# EAGLE design stirplate (EAGLE 6.5.0)
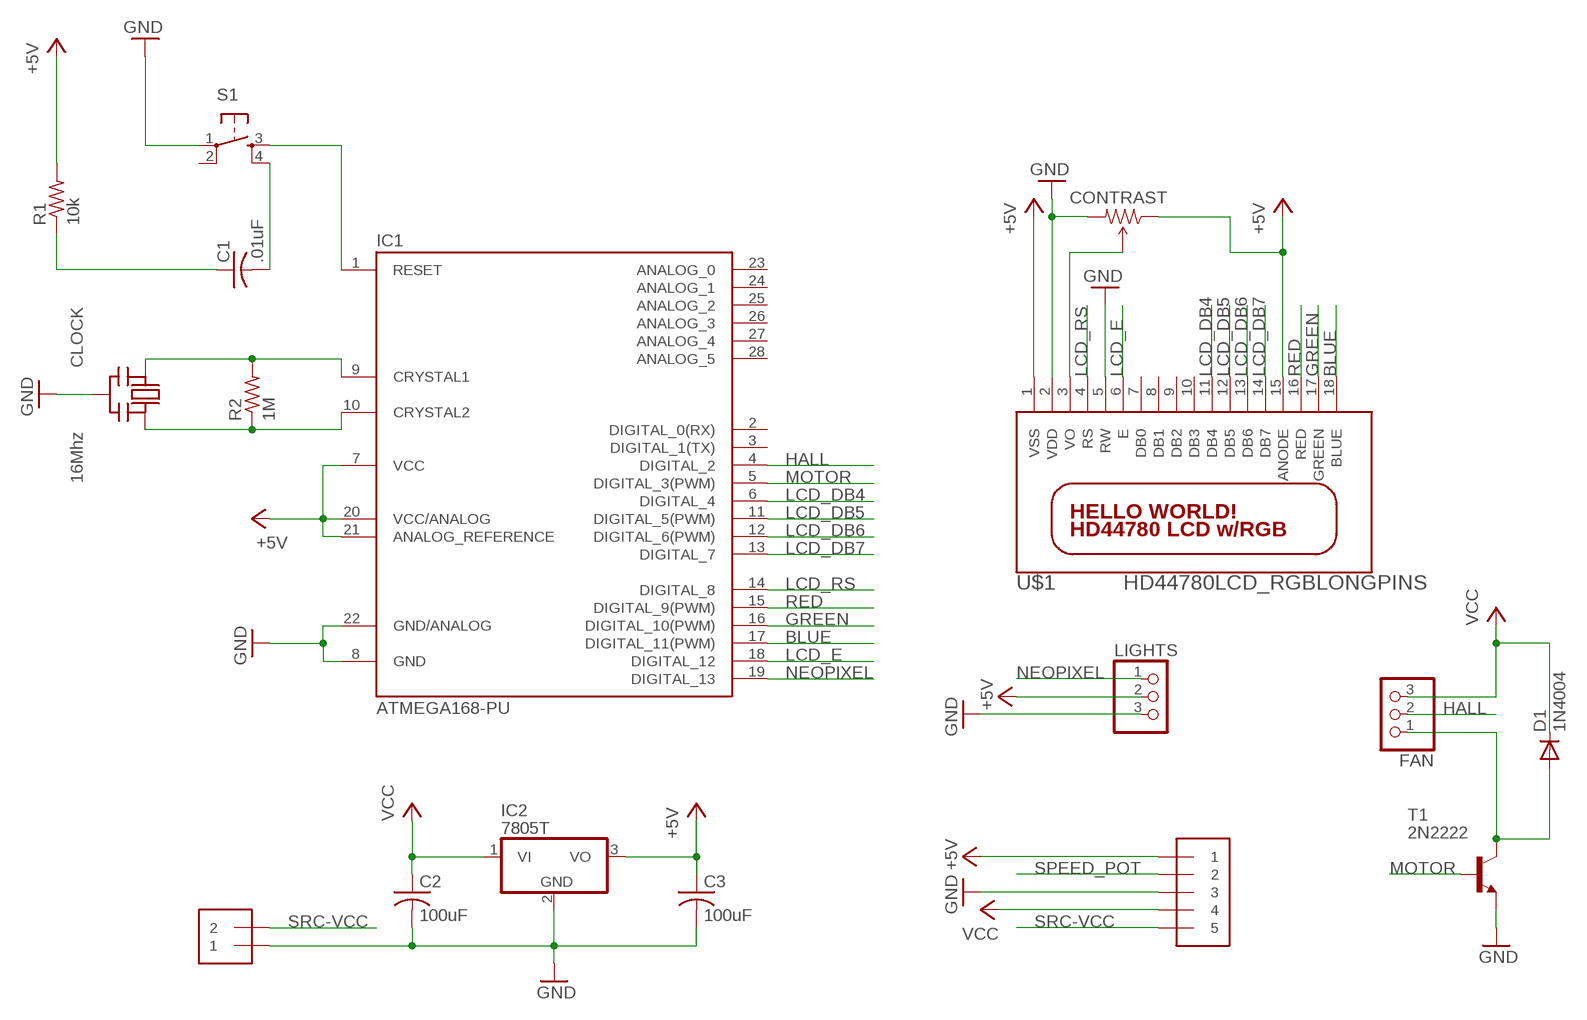
[diagram p0: schematic, sheet 1]

## Parts
C1  .01uF  C-US025-030X050  [C025-030X050]
C2  100uF  C-US025-030X050  [C025-030X050]
C3  100uF  C-US025-030X050  [C025-030X050]
CLOCK  16Mhz  CERMOSCILL-THM  [CERM_OSC]
CONTRAST  TRIMPOTPTH  [TRIM_POT_PTH]
D1  1N4004  [DO41-10]
FAN  PINHD-1X3CB  [1X03-CLEANBIG]
IC1  ATMEGA168-PU  [DIL28-3]
IC2  7805T  [TO220H]
LIGHTS  PINHD-1X3  [1X03]
POWER  1X2-3.5MM  [1X2-3.5MM]
R1  10k  R-US_0204/7  [0204/7]
R2  1M  R-US_0204/7  [0204/7]
S1  TAC_SWITCHPTH  [TACTILE-PTH]
SPEED  1X5  [1X05-3.5MM]
T1  2N2222  [TO92-EBC-OVAL]
U$1  HD44780LCD_RGBLONGPINS  [LCD1602-RGB]

## Nets
+5V [Vcc]: C3.1 CONTRAST.1(CCW) IC1.7(VCC) IC1.20(VCC/ANALOG) IC1.21(ANALOG_REFERENCE) IC2.3(VO) LIGHTS.2 R1.2 SPEED.1 U$1.15(ANODE)
BLUE: IC1.17(DIGITAL_11(PWM)) U$1.18(BLUE)
GND [Vcc]: C2.2 C3.2 CLOCK.P$2(GND) IC1.8(GND) IC1.22(GND/ANALOG) IC2.2(GND) LIGHTS.3 POWER.1 S1.1 SPEED.3 T1.E U$1.5(RW)
GREEN: IC1.16(DIGITAL_10(PWM)) U$1.17(GREEN)
HALL: FAN.2 IC1.4(DIGITAL_2)
LCD_DB4: IC1.6(DIGITAL_4) U$1.11(DB4)
LCD_DB5: IC1.11(DIGITAL_5(PWM)) U$1.12(DB5)
LCD_DB6: IC1.12(DIGITAL_6(PWM)) U$1.13(DB6)
LCD_DB7: IC1.13(DIGITAL_7) U$1.14(DB7)
LCD_E: IC1.18(DIGITAL_12) U$1.6(E)
LCD_RS: IC1.14(DIGITAL_8) U$1.4(RS)
MOTOR: IC1.5(DIGITAL_3(PWM)) T1.B
N$1: CLOCK.P$1(IN) IC1.9(CRYSTAL1) R2.2
N$2: CLOCK.P$3(OUT) IC1.10(CRYSTAL2) R2.1
N$3: C1.2 S1.4
N$4: IC1.1(RESET) S1.3
N$5: C1.1 R1.1
N$6 [Vcc]: D1.A FAN.1 T1.C
N$7: CONTRAST.2(WIPER) U$1.3(VO)
NEOPIXEL: IC1.19(DIGITAL_13) LIGHTS.1
RED: IC1.15(DIGITAL_9(PWM)) U$1.16(RED)
SPEED_POT: SPEED.2
SRC-VCC [Vcc]: POWER.2 SPEED.5
VCC [Vcc]: C2.1 D1.C FAN.3 IC2.1(VI) SPEED.4
VDD [Vcc]: CONTRAST.3(CW) U$1.2(VDD) ; supply symbol labelled GND
VSS [Vcc]: U$1.1(VSS) ; supply symbol labelled +5V
Unconnected: IC1.2(DIGITAL_0(RX)) IC1.3(DIGITAL_1(TX)) IC1.23(ANALOG_0) IC1.24(ANALOG_1) IC1.25(ANALOG_2) IC1.26(ANALOG_3) IC1.27(ANALOG_4) IC1.28(ANALOG_5) S1.2 U$1.7(DB0) U$1.8(DB1) U$1.9(DB2) U$1.10(DB3)

## Library data of the parts
C1-C3 = adafruit:C-US: CAPACITOR, American symbol
CLOCK = adafruit:CERMOSCILL: Ceramic oscillator with built in capacitors such as ZTT-12MHz http://www.ladyada.net/library/eagle
CONTRAST = SparkFun-Electromechanical:TRIMPOT: Various small potentiometers for "set-and-forget" applications
D1 = adafruit:1N4004: DIODE General purpose 1N400x type rectifier (With bigger pads) http://www.ladyada.net/library/pcb/eaglelibrary.html
FAN LIGHTS = adafruit:PINHD-1X3: PIN HEADER
IC1 = Arduino-AVR:ATMEGA168-PU
IC2 = adafruit:78*: Positive VOLTAGE REGULATOR Added bigger pads to the TO-92 package
POWER = adafruit:1X2: 3.5mm Terminal block http://www.ladyada.net/library/pcb/eaglelibrary.html
R1 R2 = adafruit:R-US_: RESISTOR, American symbol
S1 = SparkFun-Electromechanical:TAC_SWITCH: Momentary Switch Button commonly used for reset or general input. Spark Fun Electronics SKU : COM-00097 SMT- SWCH-08247
SPEED = adafruit:1X5
T1 = adafruit:2N2222: NPN TRANSISTOR Big oval pads
U$1 = adafruit:HD44780LCD_RGB

## Net classes
1 Vcc: width 0.711 mm, clearance 0.508 mm

## Board
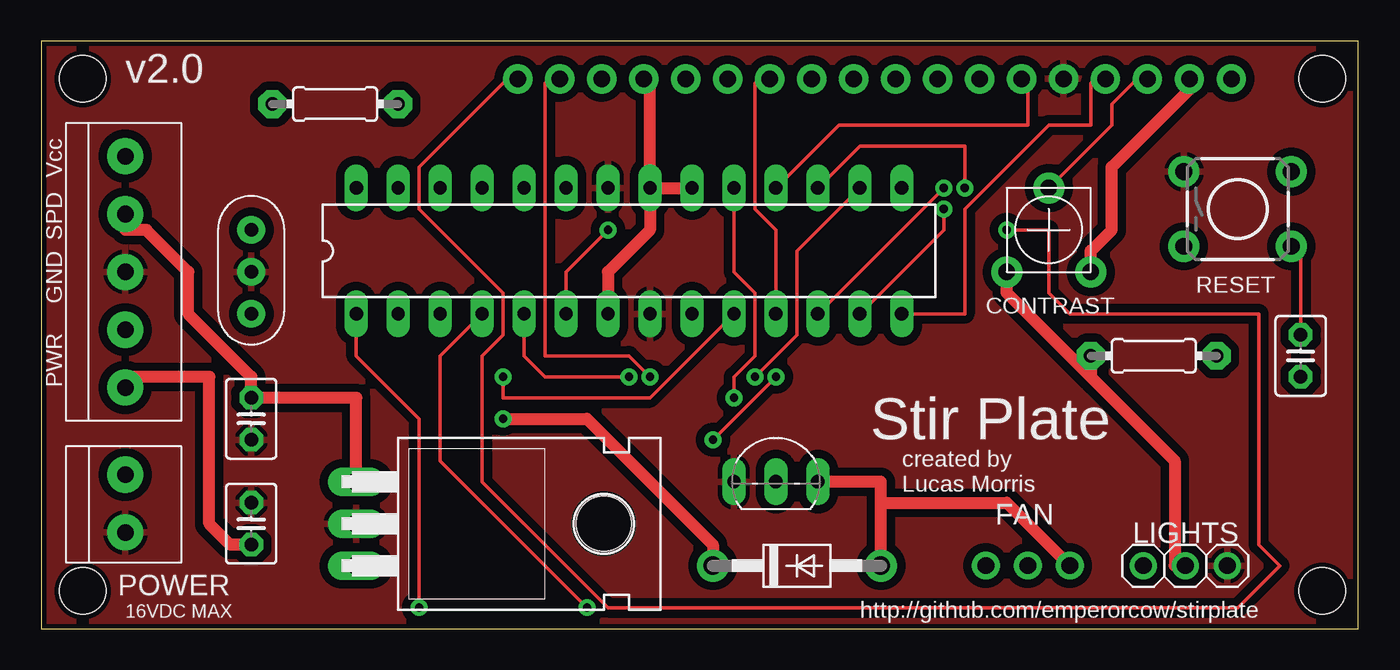
[diagram p1: board, top side]
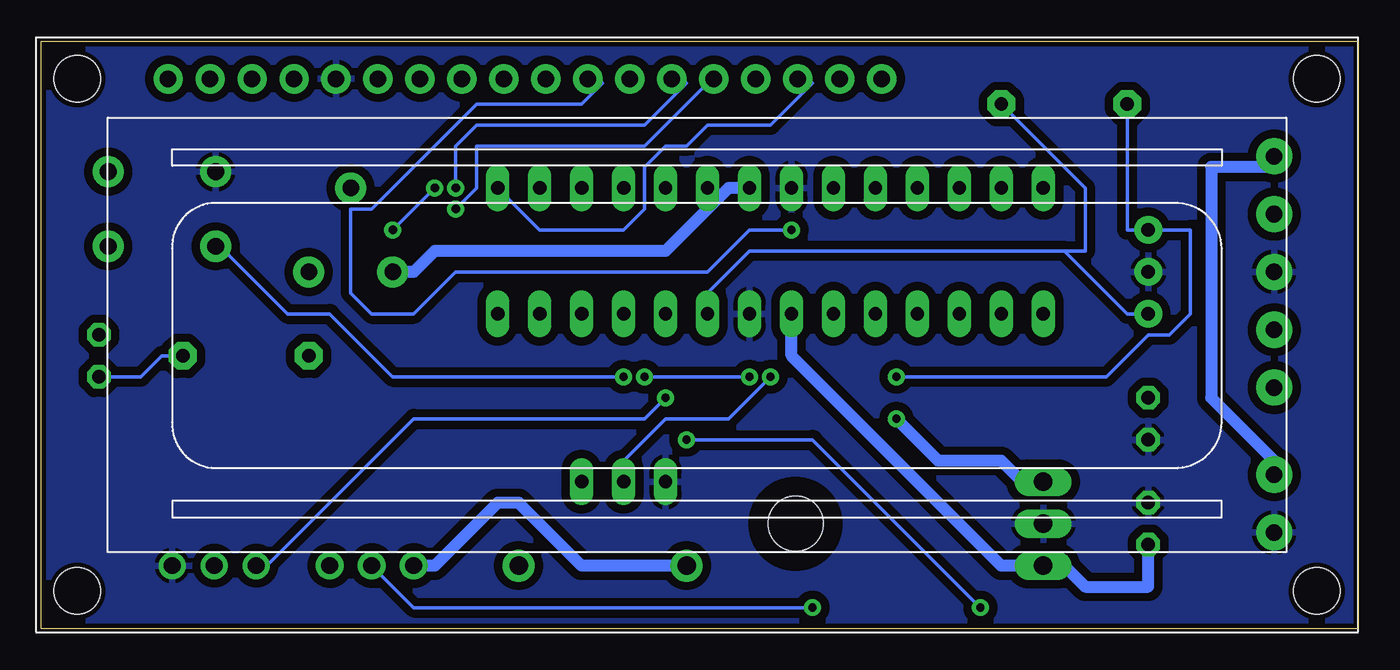
[diagram p2: board, bottom side, seen from below]

Size 79.68 x 35.55 mm. Coordinates in mm from the lower left corner, seen from the top.
Outline: 0,0 79.68,0 79.68,35.55 0,35.55 0,0
Copper layers (1*16): Top 0.035mm / dielectric 1.5mm / Bottom 0.035mm
Design rules "SparkFun": minimum track width 8mil, minimum drill 20mil, track to track 8mil, track to pad 8mil, pad to pad 8mil, via to via 8mil, smd to smd 8mil, copper to edge 10mil, drill to drill 8mil, minimum pad ring 12mil, minimum via ring 10mil, stop-mask expansion 4mil, vias tented up to drill 25mil, thermal gap 10mil

### Footprints (pad centres in the part's own frame; a part is rotated, then mirrored left to right if it is on the bottom)
C025-030X050 = drill 0.813 pad 1.422 octagon: 1 -1.27,0; 2 1.27,0
CERM_OSC = drill 0.813 pad 1.676: P$1 -2.54,0; P$2 0,0; P$3 2.54,0
TRIM_POT_PTH = drill 1 pad 1.88: 1 -2.54,-2.54; 2 0,2.54; 3 2.54,-2.54
DO41-10 = drill 1.118 pad 1.93: A 5.08,0; C -5.08,0
1X03-CLEANBIG = drill 1.016 pad 1.676: 1 -2.54,0; 2 0,0; 3 2.54,0
DIL28-3 = drill 0.813 long: 1 -16.51,-3.81; 2 -13.97,-3.81; 3 -11.43,-3.81; 4 -8.89,-3.81; 5 -6.35,-3.81; 6 -3.81,-3.81; 7 -1.27,-3.81; 8 1.27,-3.81; 9 3.81,-3.81; 10 6.35,-3.81; 11 8.89,-3.81; 12 11.43,-3.81; 13 13.97,-3.81; 14 16.51,-3.81; 15 16.51,3.81; 16 13.97,3.81; 17 11.43,3.81; 18 8.89,3.81; 19 6.35,3.81; 20 3.81,3.81; 21 1.27,3.81; 22 -1.27,3.81; 23 -3.81,3.81; 24 -6.35,3.81; 25 -8.89,3.81; 26 -11.43,3.81; 27 -13.97,3.81; 28 -16.51,3.81
TO220H = drill 1.118 long: 1 -2.54,-10.16; 2 0,-10.16; 3 2.54,-10.16 | hole 3.302: 0,4.826
1X03 = drill 1.016: 1 -2.54,0; 2 0,0; 3 2.54,0
1X2-3.5MM = drill 1 pad 2.184: 1 1.8,0; 2 -1.7,0
0204/7 = drill 0.813 pad 1.676 octagon: 1 -3.81,0; 2 3.81,0
TACTILE-PTH = drill 1.016 pad 1.88: 1 -3.251,2.261; 2 3.251,2.261; 3 -3.251,-2.261; 4 3.251,-2.261
1X05-3.5MM = drill 1 pad 2.184: 1 7,0; 2 3.5,0; 3 0,0; 4 -3.5,0; 5 -7,0
TO92-EBC-OVAL = drill 0.813 long: B 0,-1.27; C 2.54,-1.27; E -2.54,-1.27
LCD1602-RGB = drill 1 pad 1.778: 1 -32,15.5; 2 -29.46,15.5; 3 -26.92,15.5; 4 -24.38,15.5; 5 -21.84,15.5; 6 -19.3,15.5; 7 -16.76,15.5; 8 -14.22,15.5; 9 -11.68,15.5; 10 -9.14,15.5; 11 -6.6,15.5; 12 -4.06,15.5; 13 -1.52,15.5; 14 1.02,15.5; 15 3.56,15.5; 16 6.1,15.5; 17 8.64,15.5; 18 11.18,15.5 | hole 2.8: -37.5,-15.5; -37.5,15.5; 37.5,15.5; 37.5,-15.5

### Placement (x,y rotation side)
C1  76.2,16.51 90 top
C2  12.7,12.7 270 top
C3  12.7,6.35 90 top
CLOCK  12.7,21.59 90 top
CONTRAST  60.96,24.13 0 top
D1  45.72,3.81 0 top
FAN  59.69,3.81 180 top
IC1  35.56,22.86 0 top
IC2  29.21,6.35 270 top
LIGHTS  69.22,3.81 0 top
POWER  5.08,7.62 270 top
R1  67.31,16.51 180 top
R2  17.78,31.75 0 top
S1  72.39,25.4 0 top
SPEED  5.08,21.59 270 top
T1  44.45,10.16 0 top
U$1  40.01,17.78 0 bottom

### Tracks (layer width: path | path; a pad name or v marks a point on that pad's centre or on a via)
+5V
  Top 0.711: 63.5,15.24 68.58,10.16 68.58,3.81 LIGHTS.2 | R1.2 63.5,15.24 | CONTRAST.1 58.42,20.32 63.5,15.24 | IC1.7 34.29,21.59 36.83,24.13 IC1.21 | IC1.21 IC1.20 | IC1.21 36.83,33.02 U$1.15 | C3.1 11.43,5.08 10.16,6.35 10.16,15.24 5.08,15.24 SPEED.1
  Bottom 0.711: C3.1 12.7,2.54 16.51,2.54 17.78,3.81 IC2.3 21.59,3.81 34.29,16.51 IC1.7 | CONTRAST.1 57.15,21.59 55.88,22.86 41.91,22.86 38.1,26.67 IC1.21
BLUE  (via drill 0.51)
  Top 0.203: IC1.17 49.53,29.21 55.88,29.21 v55.88,26.67 | v58.42,24.13 60.96,24.13 60.96,20.32 62.23,19.05 73.66,19.05 73.66,5.08 74.93,3.81 72.39,1.27 34.29,1.27 26.67,8.89 26.67,16.51 27.94,17.78 27.94,20.32 22.86,25.4 22.86,27.94 27.94,33.02 U$1.18
  Bottom 0.203: v58.42,24.13 v55.88,26.67
GND
  pour Bottom (isolate 0.305): 0,35.56 0,0 80.01,0 80.01,35.56
  pour Top (isolate 0.305): 0,35.56 0,0 80.01,0 80.01,35.56
GREEN  (via drill 0.51)
  Top 0.203: IC1.16 45.72,22.86 45.72,17.78 v43.18,15.24 | v36.83,15.24 35.56,16.51 30.48,16.51 30.48,33.02 U$1.17
  Bottom 0.203: v36.83,15.24 v43.18,15.24
HALL  (via drill 0.51)
  Top 0.203: IC1.4 24.13,16.51 24.13,10.16 v33.02,1.27
  Bottom 0.203: v33.02,1.27 57.15,1.27 FAN.2
LCD_DB4  (via drill 0.51)
  Top 0.203: IC1.6 31.75,21.59 v34.29,24.13
  Bottom 0.203: v34.29,24.13 36.83,24.13 39.37,21.59 54.61,21.59 57.15,19.05 59.69,19.05 60.96,20.32 60.96,25.4 59.69,25.4 53.34,31.75 46.99,31.75 45.72,33.02 U$1.11
LCD_DB5
  Top 0.203: IC1.11 44.45,24.13 43.18,25.4 43.18,33.02 U$1.12
LCD_DB6  (via drill 0.51)
  Top 0.203: v54.61,26.67 IC1.12
  Bottom 0.203: v54.61,26.67 54.61,29.21 53.34,30.48 43.18,30.48 40.64,33.02 U$1.13
LCD_DB7  (via drill 0.51)
  Top 0.203: IC1.13 54.61,24.13 v54.61,25.4
  Bottom 0.203: v54.61,25.4 53.34,26.67 53.34,29.21 43.18,29.21 39.37,33.02 U$1.14
LCD_E
  Top 0.203: IC1.18 48.26,30.48 59.69,30.48 59.69,33.02 U$1.6
LCD_RS
  Top 0.203: IC1.14 55.88,19.05 55.88,25.4 60.96,30.48 63.5,30.48 63.5,33.02 U$1.4
MOTOR  (via drill 0.51)
  Top 0.203: IC1.5 29.21,16.51 30.48,15.24 v35.56,15.24
  Bottom 0.203: v35.56,15.24 38.1,12.7 41.91,12.7 44.45,10.16 T1.B
N$1
  Bottom 0.203: IC1.9 39.37,20.32 36.83,22.86 17.78,22.86 | 17.78,22.86 13.97,19.05 CLOCK.P$1 | R2.2 16.51,26.67 16.51,22.86 17.78,22.86
N$2  (via drill 0.51)
  Top 0.203: IC1.10 36.83,13.97 27.94,13.97 v27.94,15.24
  Bottom 0.203: v27.94,15.24 15.24,15.24 12.7,17.78 11.43,17.78 10.16,19.05 10.16,24.13 CLOCK.P$3 13.97,24.13 R2.1
N$3
  Top 0.203: C1.2 76.2,22.86 S1.4
N$4  (via drill 0.51)
  Top 0.203: IC1.1 19.05,16.51 22.86,12.7 v22.86,1.27 | v44.45,15.24 v40.64,11.43
  Bottom 0.203: v22.86,1.27 33.02,11.43 v40.64,11.43 | v44.45,15.24 58.42,15.24 62.23,19.05 64.77,19.05 68.58,22.86 S1.3
N$5
  Bottom 0.203: C1.1 73.66,15.24 72.39,16.51 R1.1
N$6
  Top 0.711: T1.C 50.8,8.89 50.8,7.62 | D1.A 50.8,7.62 | FAN.1 58.42,7.62 50.8,7.62
N$7
  Top 0.203: CONTRAST.2 64.77,30.48 64.77,31.75 66.04,33.02 U$1.3
NEOPIXEL  (via drill 0.51)
  Top 0.203: IC1.19 41.91,21.59 43.18,20.32 43.18,16.51 41.91,15.24 v41.91,13.97
  Bottom 0.203: v41.91,13.97 43.18,12.7 57.15,12.7 66.04,3.81 LIGHTS.1
RED
  Bottom 0.203: IC1.15 49.53,24.13 44.45,24.13 43.18,25.4 43.18,27.94 41.91,29.21 40.64,29.21 39.37,30.48 35.56,30.48 33.02,33.02 U$1.16
SRC-VCC
  Bottom 0.711: POWER.2 5.08,10.16 8.89,13.97 8.89,27.94 5.08,27.94 SPEED.5
VCC  (via drill 0.51)
  Top 0.711: IC2.1 19.05,13.97 C2.1 12.7,15.24 8.89,19.05 8.89,21.59 6.35,24.13 5.08,24.13 SPEED.4 | D1.C 40.64,5.08 33.02,12.7 v27.94,12.7
  Bottom 0.711: FAN.3 55.88,3.81 52.07,7.62 50.8,7.62 46.99,3.81 D1.C | v27.94,12.7 25.4,10.16 21.59,10.16 20.32,8.89 IC2.1
VDD
  Top 0.711: CONTRAST.3 63.5,22.86 64.77,24.13 64.77,27.94 69.85,33.02 U$1.2

### Text on the board
tPlace: v2.0 | Vcc | SPD | GND | RESET | CONTRAST | PWR | Stir Plate | created by / Lucas Morris | 16VDC MAX | http://github.com/emperorcow/stirplate